# Altium schematic sheet Microcontroller Schematic.SchDoc
size A; SheetNumber: 1; SheetTotal: 1
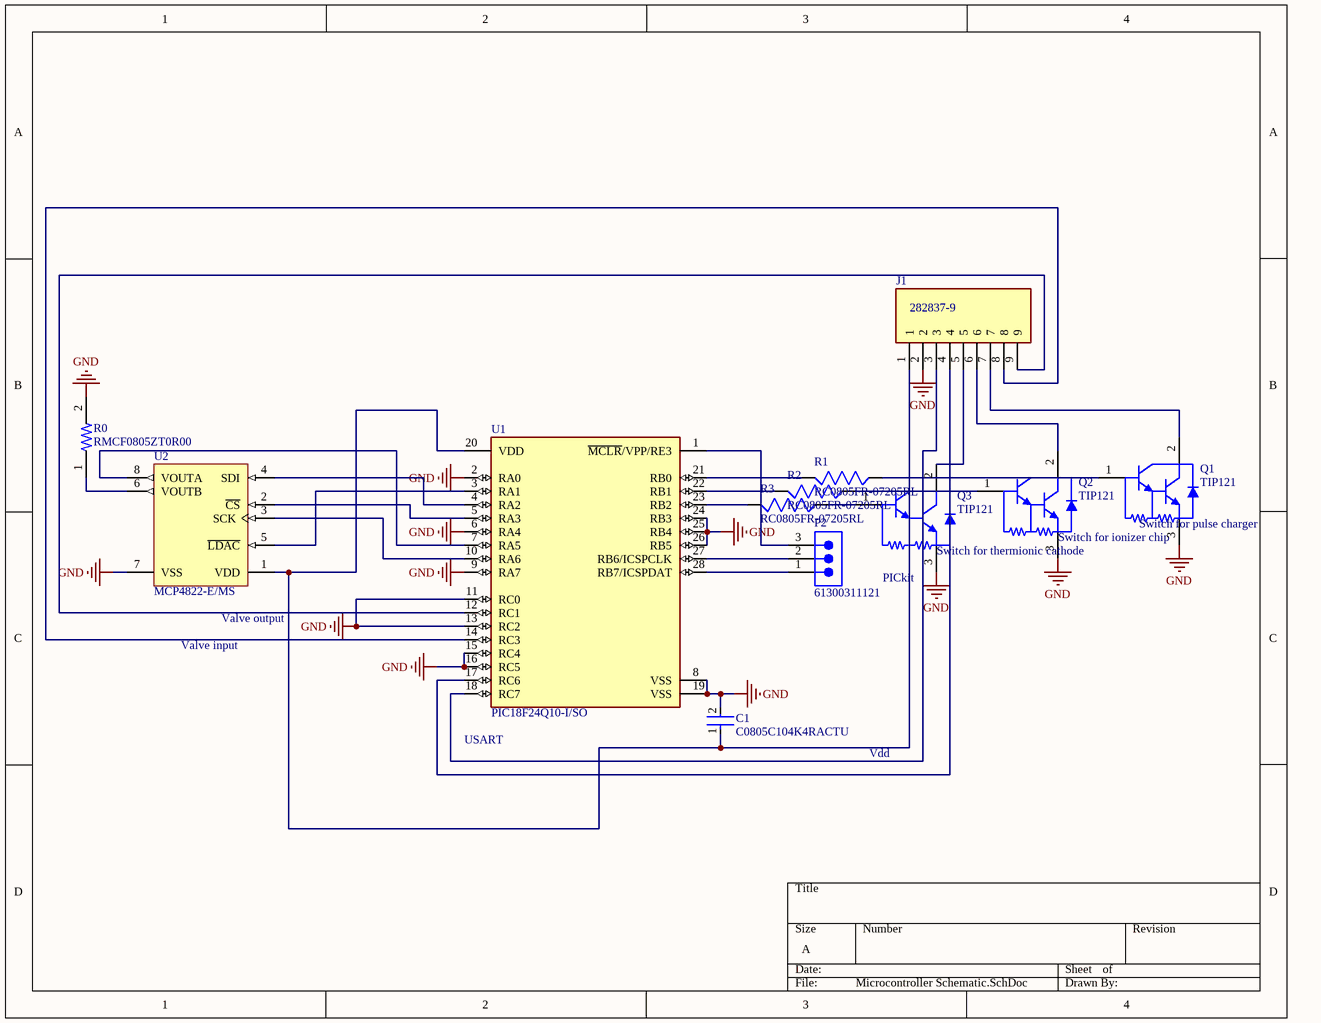
[diagram p0: Microcontroller Schematic.SchDoc]

## Parts
C1  C0805C104K4RACTU  [FP-C0805C-DN-IPC_A]
J1  282837-9  [TE_282837-9]
P2  61300311121  [61300311121]
Q1  TIP121  [ONSC-TO-220-3-221A-09]
Q2  TIP121  [ONSC-TO-220-3-221A-09]
Q3  TIP121  [ONSC-TO-220-3-221A-09]
R0  RMCF0805ZT0R00  [RESC2012X60N]
R1  RC0805FR-07205RL  [RESC2012X60]
R2  RC0805FR-07205RL  [RESC2012X60]
R3  RC0805FR-07205RL  [RESC2012X60]
U1  PIC18F24Q10-I/SO  [FP-C04-052-IPC_A]
U2  MCP4822-E/MS  [MSOP-MS8_L]

## Nets
GND: C1.2 J1.2 Q1.3(E) Q2.3(E) Q3.3(E) R0.2 U1.2(RA0) U1.6(RA4) U1.8(VSS) U1.9(RA7) U1.11(RC0) U1.13(RC2) U1.15(RC4) U1.16(RC5) U1.19(VSS) U1.24(RB3) U1.25(RB4) U1.26(RB5) U2.7(VSS)
NetC1_1: C1.1 J1.1 U1.20(VDD) U2.1(VDD)
NetJ1_3: J1.3 U1.18(RC7)
NetJ1_4: J1.4 U1.17(RC6)
NetJ1_5: J1.5 Q3.2(C)
NetJ1_6: J1.6 Q2.2(C)
NetJ1_7: J1.7 Q1.2(C)
NetJ1_8: J1.8 U1.14(RC3)
NetJ1_9: J1.9 U1.12(RC1)
NetP2_1: P2.1 U1.28(RB7/ICSPDAT)
NetP2_2: P2.2 U1.27(RB6/ICSPCLK)
NetP2_3: P2.3 U1.1(~{MCLR}/VPP/RE3)
NetQ1_1: Q1.1(B) R1.2
NetQ2_1: Q2.1(B) R2.2
NetQ3_1: Q3.1(B) R3.2
NetR0_1: R0.1 U2.6(VOUTB)
NetR1_1: R1.1 U1.21(RB0)
NetR2_1: R2.1 U1.22(RB1)
NetR3_1: R3.1 U1.23(RB2)
NetU1_3: U1.3(RA1) U2.5(~{LDAC})
NetU1_4: U1.4(RA2) U2.4(SDI)
NetU1_5: U1.5(RA3) U2.2(~{CS})
NetU1_7: U1.7(RA5) U2.8(VOUTA)
NetU1_10: U1.10(RA6) U2.3(SCK)

## Notes on the sheet
- (near Q3) Switch for thermionic cathode
- (near Q2) Switch for ionizer chip
- (near Q1) Switch for pulse charger
- (near U2) Valve output
- PICkit
- Valve input
- (near U1) USART
- Vdd

## Library data of the parts
C1 = CMP-2007-00274-2: CAP CER 0.1UF 16V X7R 0805; Manufacturer: KEMET; Material: Ceramic; Tolerance: 0.1; Capacitance: 0.10 μF; Value: 0.10 μF; Temperature Coefficient: 30ppm/°C; Device Class L3: Ceramic Capacitors; RoHS: TRUE; Octopart: https://octopart.com/c0805c104k4ractu-kemet-92155; ComponentLink2Description: Datasheet; ComponentLink2URL: https://content.kemet.com/datasheets/KEM_C1003_C0G_SMD.pdf; Temperature Range High: +125°C; Category: Cap; Lead Free: Yes; Digikey Description: CAP CER 0.1UF 16V X7R 0805; Automotive: No; Temperature Range Low: -55°C; Voltage Rating: 16 V; Package: C0805C-DN; Ipc Land Pattern Name: CAPC200125X78; Manufacturer Part Number: C0805C104K4RACTU; Height: 0.88mm; Device Class L1: Passive Components; Temperature: -55°C to +125°C; Mouser Description: Multilayer Ceramic Capacitors MLCC - SMD/SMT 16volts 0.1uF X7R 10%; Device Class L2: Capacitors; Temperature Characteristic: X7R
J1 = 282837-9: MF: {'manufacturer': 'TE Connectivity'}; Package: None; MP: 282837-9; Value: *; Availability: Unavailable; Price: None
P2 = CMP-1502-01062-2: NexarPartId: 32855521; Voltage Rating: 250V; Current Rating: 3A; Connector Type: Male Pin; Number of Positions: 3; Gender: Male; Contact Resistance: 20mΩ; Pitch: 2.54mm; Max Operating Temperature: 105°C; Lead Pitch: 2.54mm; Lead Free: Lead Free; Contact Mating Length: 5.9944mm; Contact Material: Copper; Number of Pins: 3; Orientation: Vertical; Height: 8.94mm; Packaging: Bulk; Min Operating Temperature: -40°C; Mount: Through Hole; RoHS: Compliant; Number of Contacts: 3; Operating Supply Voltage: 250V; Termination: Solder; Number of Rows: 1; Contact Plating: Gold; Color: Black; REACH SVHC: Unknown
Q1-Q3 = CMP-1047-00128-1: Plastic Medium-Power, Complementary Silicon Transistor, 3-Pin TO-220, Tube; Manufacturer: On Semiconductor; Polarity: NPN; IC Continuous (A): 5; ComponentLink1URL: http://www.onsemi.com/; PackageReference: TO-220-3-221A-09; ComponentLink1Description: Manufacturer URL; RoHS: FALSE; ComponentLink2URL: http://www.onsemi.cn/pub_link/Collateral/TIP120-D.PDF; PackageDescription: 3-Pin Flange Mount, Vertical Straight Lead, Body 9.97 x 4.445 mm, Pitch 2.54 mm; PackageVersion: Rev. AG, 09/2011; DatasheetVersion: Rev. 8; ComponentLink3URL: http://www.onsemi.com/pub_link/Collateral/221A-09.PDF; PartNumber: TIP121; ComponentLink2Description: Datasheet; Packing: Tube; ComponentLink3Description: Package Specification; Mounting Technology: Through Hole
R0 = RMCF0805ZT0R00: 0 Ohms Jumper 0.125W, 1/8W Chip Resistor 0805 (2012 Metric) Automotive AEC-Q200 Thick Film; MF: Stackpole Electronics; DigiKey-Purchase-URL: https://snapeda.com/shop?store=DigiKey&id=492501; Package: 0805 Stackpole Electronics; Value: *; Availability: Unavailable; MP: RMCF0805ZT0R00; SnapEDA_Link: https://www.snapeda.com/parts/RMCF0805ZT0R00/Stackpole%20Electronics%20Inc/view-part/492501/?ref=snap; Price: None
R1-R3 = RC0805FR-07205RL: RC Series 0805 0.125 W 2 kOhms 5% Â±100 ppm/Â°C SMT Thick Film Chip Resistor; MF: {'manufacturer': u'YAGEO'}; Package: None; Price: None; Value: *; MP: RC0805FR-07205RL; Availability: Unavailable
U1 = CMP-06276-000706-1: IC MCU 8BIT 16KB FLASH 28SOIC; Oscillator Type: Internal; Core Architecture: PIC; Number of I/Os: 25; Interface: I2C; Peripherals: Brown-out Detect/Reset; Frequency: 64MHz; Min Operating Temperature: -40°C; Case/Package: SOIC; Packaging: Rail/Tube; Memory Size: 16KB; Memory Type: FLASH; Series: PIC® XLP™ 18Q; Max Operating Temperature: 85°C
U2 = CMP-0188-00137-2: 12-Bit DACs with Internal VREF and SPI Interface, 8-Pin MSOP, Extended Temperature; ComponentLink1Description: Manufacturer URL; PackageReference: MSOP-MS8; DatasheetVersion: revA, Apr-2010; ComponentLink3Description: Package Specification; PackageDescription: 8-Lead Plastic Micro Small Outline Package (MS) [MSOP]; RevisionNote: URLs added. DatasheetVersion updated. Sch updated.; ComponentLink2Description: Datasheet; ComponentLink2URL: http://ww1.microchip.com/downloads/en/DeviceDoc/22249A.pdf; ComponentLink1URL: http://www.microchip.com/; PackageVersion: revBB, Aug-2009; ComponentLink3URL: http://www.microchip.com/stellent/groups/techpub_sg/documents/packagingspec/en012702.pdf